# EAGLE schematic Soap (EAGLE 7.1.0)
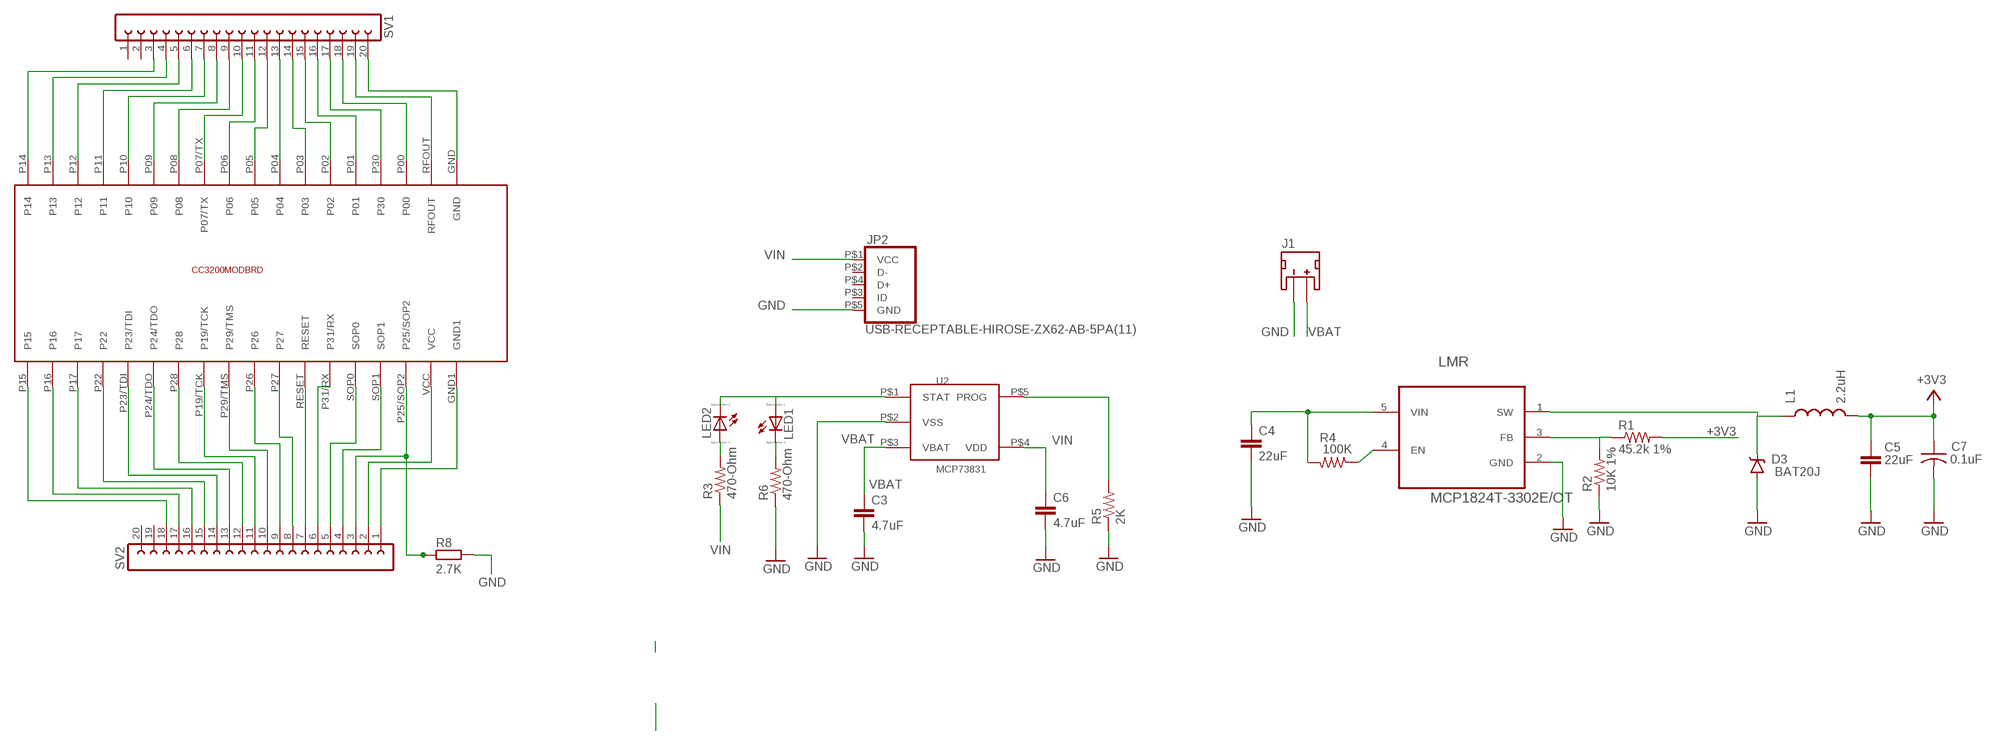
[diagram p0: schematic, sheet 1]

## Parts
C3  4.7uF  CAP0603-CAP  [0603-CAP]
C4  22uF  C-EUC0603  [C0603]
C5  22uF  C-EUC0603  [C0603]
C6  4.7uF  CAP0603-CAP  [0603-CAP]
C7  0.1uF  C-USC0402  [C0402]
D3  BAT20J  DIODE-SCHOTTKY-BAT20J  [SOD-323]
J1  JST_2MM_MALE  [JST-2-SMD]
JP2  USB-RECEPTABLE-HIROSE-ZX62-AB-5PA(11)  [HIROSE-ZX62-AB-5PA(11)]
L1  2.2uH  INDUCTOR-SPARKFUN0805  [0805]
LED1  LED_E  [LED_1206]
LED2  LED_E  [LED_1206]
LMR  MCP1824T-3302E/OT  [SOT95P270X145-5N]
R1  45.2k 1%  RESISTOR0603  [0603-RES]
R2  10K 1%  RESISTOR0603  [0603-RES]
R3  470-Ohm  RESISTOR0603  [0603-RES]
R4  100K  R-US_R0402  [R0402]
R5  2K  RESISTOR0603  [0603-RES]
R6  470-Ohm  RESISTOR0603  [0603-RES]
R8  2.7K  RESISTOR  [R0603]
SV1  FE20-1  [FE20]
SV2  FE20-1  [FE20]
U2  MCP73831  [5PIN_SOT23]
U$1  CC3200MOD  [CC3200MOD]

## Nets
+3V3: C5.1 C7.1 L1.2 R1.2 SV2.2 U$1.VCC
FB: LMR.3(FB) R1.1 R2.2
GND [vcc]: C3.2 C4.2 C5.2 C6.2 C7.2 D3.A J1.1(-) JP2.P$5(GND) LMR.2(GND) R2.1 R5.1 R6.1 R8.2 SV1.20 SV2.1 U2.P$2(VSS) U$1.GND U$1.GND1
N$1: LED2.A R3.2
N$2: LMR.4(EN) R4.1
N$3: R5.2 U2.P$5(PROG)
N$4: SV2.18 U$1.P15
N$5: LED1.C R6.2
N$6: SV2.17 U$1.P16
N$7: SV2.16 U$1.P17
N$8: SV2.15 U$1.P22
N$9: SV2.14 U$1.P23/TDI
N$10: SV2.13 U$1.P24/TDO
N$11: SV2.12 U$1.P28
N$12: SV2.11 U$1.P19/TCK
N$13: SV2.10
N$14: SV1.3 U$1.P14
N$15: SV1.4 U$1.P13
N$16: SV1.5 U$1.P12
N$17: SV1.6 U$1.P11
N$18: SV1.7 U$1.P10
N$19: SV1.8 U$1.P09
N$20: SV1.9 U$1.P08
N$21: SV1.10 U$1.P07/TX
N$22: SV1.11 U$1.P06
N$23: SV1.12 U$1.P05
N$24: SV1.13 U$1.P04
N$25: SV1.14 U$1.P03
N$26: SV1.15 U$1.P02
N$27: SV1.16 U$1.P01
N$28: SV1.17 U$1.P30
N$29: SV1.18 U$1.P00
N$30: SV1.19 U$1.RFOUT
N$32: SV2.9 U$1.P26
N$33: SV2.8 U$1.P27
N$34: SV2.7 U$1.RESET
N$35: SV2.6 U$1.P31/RX
N$36: SV2.5 U$1.SOP0
N$37: SV2.4 U$1.SOP1
SOP2: R8.1 SV2.3 U$1.P25/SOP2
STAT: LED1.A LED2.C U2.P$1(STAT)
SW: D3.C L1.1 LMR.1(SW)
VBAT [vcc]: C3.1 C4.1 J1.2(+) LMR.5(VIN) R4.2 U2.P$3(VBAT)
VIN: C6.1 JP2.P$1(VCC) R3.1 U2.P$4(VDD)
Unconnected: J1.NC1(PAD1) J1.NC2(PAD2) JP2.P$2(D-) JP2.P$3(ID) JP2.P$4(D+) SV1.1 SV1.2 SV2.19 SV2.20 U$1.P29/TMS

## Library data of the parts
C3 C6 = SparkFun-Capacitors:CAP: Capacitor Standard 0603 ceramic capacitor, and 0.1" leaded capacitor.
C4 C5 = rcl:C-EU: CAPACITOR, European symbol
C7 = adafruit:C-US: CAPACITOR, American symbol
D3 = SparkFun-DiscreteSemi:DIODE-SCHOTTKY: Schottky diodes in SFE's production catalog BAT20J 1A 23V 0.62Vf RB751 120mA 40V 0.37Vf PMEG4005EJ 0.5A 40V 0.42Vf MBRA140 1A 40V 0.5Vf B340A 3A 40V SMA; PROD_ID: DIO-11623
J1 = SparkFun-Connectors:JST_2MM_MALE: Mates to single-cell LiPo batteries. CONN-08352; PROD_ID: CONN-08352
JP2 = daspilker:USB-RECEPTABLE: USB Receptable
L1 = Spark:INDUCTOR-SPARKFUN: Inductors Basic Inductor/Choke - 0603 and 1206. Footprints are not proven and vary greatly between part numbers. SRN6045- 33uH, 20% 1.4A
LED1 LED2 = eagle-ltspice:LED_E: LED Source: http://www.osram.convergy.de Source: www.luxeon.com Source: www.kingbright.com; SPICEMODEL: NONE; SPICEPREFIX: D; SPICETYPE: diode
LMR = Microchip_By_element14_Batch_1:MCP1824T-3302E/OT: 300 mA, Low Voltage, Low Quiescent Current LDO Regulator; MPN: MCP1824T-3302E/OT; OC_FARNELL: 1578387; OC_NEWARK: 40M0704; PACKAGE: SOT23-5; SUPPLIER: Microchip
R1-R3 R5 R6 = SparkFun-Resistors:RESISTOR: Resistor Basic schematic elements and footprints for 0603, 1206, and PTH resistors.
R4 = adafruit:R-US_: RESISTOR, American symbol
R8 = BaseApp:RESISTOR: Resistance Package :- 0603 Mount :-Surface mount
SV1 SV2 = con-lsta:FE20-1: FEMALE HEADER; OC_FARNELL: unknown; OC_NEWARK: unknown
U2 = BaseApp:MCP73831: Digikey No:- __MCP73831T-2ACI/OTCT-ND__
U$1 = CC3200MODBRD:CC3200MOD

## Net classes
2 RF: width 0.381 mm, clearance 0.381 mm